# EAGLE design balancer winston-odpor (EAGLE 7.2.0)
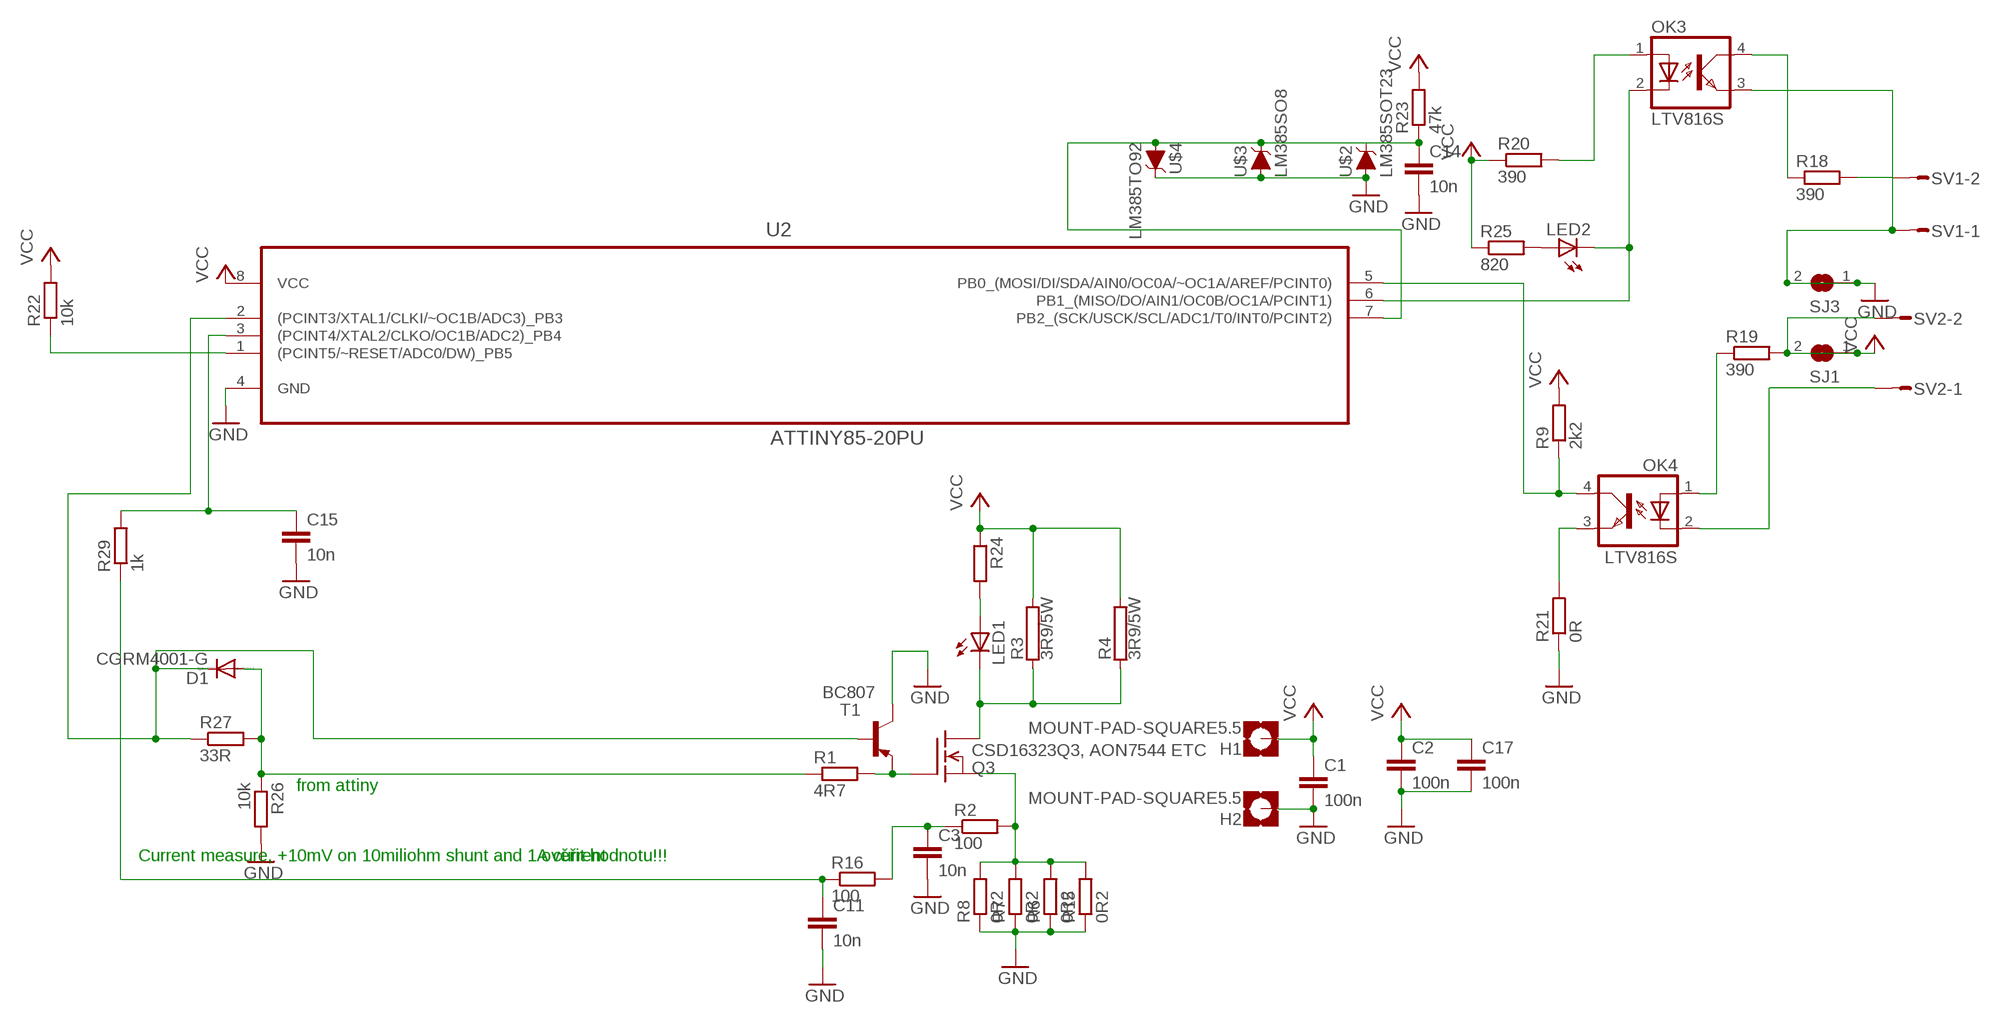
[diagram p0: schematic, sheet 1]

## Parts
C1  100n  C-EUC1210K  [C1210K]
C2  100n  C-EUC1210K  [C1210K]
C3  10n  C-EUC0603  [C0603]
C11  10n  C-EUC0603  [C0603]
C14  10n  C-EUC0603  [C0603]
C15  10n  C-EUC0603  [C0603]
C17  100n  C-EUC1210K  [C1210K]
D1  CGRM4001-G  [SOD-123_MINI-SMA]
H1  MOUNT-PAD-SQUARE5.5  [5,5-PAD-SQUARE]
H2  MOUNT-PAD-SQUARE5.5  [5,5-PAD-SQUARE]
LED1  LED3MM  [LED3MM]
LED2  LED3MM  [LED3MM]
OK3  LTV816S  [SMD4]
OK4  LTV816S  [SMD4]
Q3  CSD16323Q3, AON7544 ETC  CSD16323Q3  [SON33X33]
R1  4R7  R-EU_R0603  [R0603]
R2  100  R-EU_R0603  [R0603]
R3  3R9/5W  RHPS932  [HPS932]
R4  3R9/5W  RHPS932  [HPS932]
R6  0R2  R-EU_M1206  [M1206]
R7  0R2  R-EU_M1206  [M1206]
R8  0R2  R-EU_M1206  [M1206]
R9  2k2  R-EU_R0603  [R0603]
R15  0R2  R-EU_M1206  [M1206]
R16  100  R-EU_R0603  [R0603]
R18  390  R-EU_R0603  [R0603]
R19  390  R-EU_R0603  [R0603]
R20  390  R-EU_R0603  [R0603]
R21  0R  R-EU_R0603  [R0603]
R22  10k  R-EU_R0805  [R0805]
R23  47k  R-EU_R0603  [R0603]
R24  R-EU_R0603  [R0603]
R25  820  R-EU_R0805  [R0805]
R26  10k  R-EU_R0603  [R0603]
R27  33R  R-EU_R0603  [R0603]
R29  1k  R-EU_R0603  [R0603]
SJ1  SJ  [SJ]
SJ3  SJ  [SJ]
SV1  S02P  [S02P]
SV2  S02P  [S02P]
T1  BC807  BC807-16LT1-PNP-SOT23-BEC  [SOT23-BEC]
U2  ATTINY85-20PU  [DIP254P762X533-8]
U$2  LM385SOT23  [SOT23-3]
U$3  LM385SO8  [SO08]
U$4  LM385TO92  [TO-92]

## Nets
GND: C1.2 C2.2 C3.2 C11.2 C14.2 C15.2 C17.2 H2.B5,5(MOUNT) OK3.3(EMIT) R6.1 R7.1 R8.1 R15.1 R21.1 R26.2 SJ3.1 SJ3.2 SV1.1 T1.C U2.4(GND) U$2.1(A) U$3.8(A) U$4.3(C)
N$1: C3.1 R2.1 R16.2
N$2: Q3.4(G) R1.2 T1.E
N$4: Q3.1(S) Q3.2(S) Q3.3(S) R2.2 R6.2 R7.2 R8.2 R15.2
N$16: C15.1 R29.2 U2.3((PCINT4/XTAL2/CLKO/OC1B/ADC2)_PB4)
N$19: C11.1 R16.1 R29.1
N$22: LED1.K(C) Q3.EXP(D) R3.1 R4.1
N$23: LED2.K(C) OK3.2(C) U2.6(PB1_(MISO/DO/AIN1/OC0B/OC1A/PCINT1))
N$24: OK4.1(A) R19.1
N$26: OK4.2(C) SV2.1
N$27: R18.2 SV1.2
N$28: R22.1 U2.1((PCINT5/~RESET/ADC0/DW)_PB5)
N$29: D1.A R1.1 R26.1 R27.2
N$30: D1.C R27.1 T1.B U2.2((PCINT3/XTAL1/CLKI/~OC1B/ADC3)_PB3)
N$31: LED1.A R24.2
N$32: LED2.A R25.2
N$33: OK3.1(A) R20.2
N$35: OK3.4(COL) R18.1
N$37: C14.1 R23.1 U2.7(PB2_(SCK/USCK/SCL/ADC1/T0/INT0/PCINT2)) U$2.2(C) U$3.4(C) U$4.2(A)
N$38: OK4.3(EMIT) R21.2
N$39: OK4.4(COL) R9.1 U2.5(PB0_(MOSI/DI/SDA/AIN0/OC0A/~OC1A/AREF/PCINT0))
VCC: C1.1 C2.1 C17.1 H1.B5,5(MOUNT) R3.2 R4.2 R9.2 R19.2 R20.1 R22.2 R23.2 R24.1 R25.1 SJ1.1 SJ1.2 SV2.2 U2.8(VCC)

## Notes on the sheet
- from attiny
- Current measure, +10mV on 10miliohm shunt and 1A current | ověřit hodnotu!!!

## Library data of the parts
C1-C3 C11 C14 C15 C17 = resistor:C-EU: CAPACITOR, European symbol
D1 = diode:CGRM400*-G: Molded plasitc,JEDEC SOD-123/Mini SMA Source: Comchip CGRM4001-G.pdf
H1 H2 = holes:MOUNT-PAD-SQUARE: MOUNTING PAD, square
LED1 LED2 = led:LED: LED OSRAM: - CHIPLED LG R971, LG N971, LY N971, LG Q971, LY Q971, LO R971, LY R971 LH N974, LH R974 LS Q976, LO Q976, LY Q976 LO Q996 - Hyper CHIPLED LW Q18S LB Q993, LB Q99A, LB R99A - SideLED LS A670, LO A670, LY A670, LG A670, LP A670 LB A673, LV A673, LT A673, LW A673 LH A674 LY A675 LS A676, LA A676, LO A676, LY A676, LW A676 LS A679, LY A679, LG A679 - Hyper Micro SIDELED® LS Y876, LA Y876, LO Y876, LY Y876 LT Y87S - SmartLED LW L88C, LW L88S LB L89C, LB L89S, LG L890 LS L89K, LO L89K, LY L89K LS L896, LA L896, LO L896, LY L896 - TOPLED LS T670, LO T670, LY T670, LG T670, LP T670 LSG T670, LSP T670, LSY T670, LOP T670, LYG T670 LG T671, LOG T671, LSG T671 LB T673, LV T673, LT T673, LW T673 LH T674 LS T676, LA T676, LO T676, LY T676, LB T676, LH T676, LSB T676, LW T676 LB T67C, LV T67C, LT T67C, LS T67K, LO T67K, LY T67K, LW E67C LS E67B, LA E67B, LO E67B, LY E67B, LB E67C, LV E67C, LT E67C LW T67C LS T679, LY T679, LG T679 LS T770, LO T770, LY T770, LG T770, LP T770 LB T773, LV T773, LT T773, LW T773 LH T774 LS E675, LA E675, LY E675, LS T675 LS T776, LA T776, LO T776, LY T776, LB T776 LHGB T686 LT T68C, LB T68C - Hyper Mini TOPLED® LB M676 - Mini TOPLED Santana® LG M470 LS M47K, LO M47K, LY M47K Source: http://www.osram.convergy.de LUXEON: - LUMILED® LXK2-PW12-R00, LXK2-PW12-S00, LXK2-PW14-U00, LXK2-PW14-V00 LXK2-PM12-R00, LXK2-PM12-S00, LXK2-PM14-U00 LXK2-PE12-Q00, LXK2-PE12-R00, LXK2-PE12-S00, LXK2-PE14-T00, LXK2-PE14-U00 LXK2-PB12-K00, LXK2-PB12-L00, LXK2-PB12-M00, LXK2-PB14-N00, LXK2-PB14-P00, LXK2-PB14-Q00 LXK2-PR12-L00, LXK2-PR12-M00, LXK2-PR14-Q00, LXK2-PR14-R00 LXK2-PD12-Q00, LXK2-PD12-R00, LXK2-PD12-S00 LXK2-PH12-R00, LXK2-PH12-S00 LXK2-PL12-P00, LXK2-PL12-Q00, LXK2-PL12-R00 Source: www.luxeon.com KINGBRIGHT: KA-3528ASYC Source: www.kingbright.com
OK3 OK4 = optocoupler:LTV816: OPTO COUPLER Source: LITEON, LTV816.pdf; OC_FARNELL: unknown; OC_NEWARK: unknown
Q3 = SON33:CSD16323Q3
R1 R2 R6-R9 R15 R16 R18-R27 R29 = resistor:R-EU_: RESISTOR, European symbol
R3 R4 = resistor-power:R: Power Resitor; OC_FARNELL: unknown; OC_NEWARK: unknown
SJ1 SJ3 = jumper:SJ: SMD solder JUMPER
SV1 SV2 = con-amp-mt:S02P: AMP MT CONNECTOR; OC_FARNELL: unknown; OC_NEWARK: unknown
T1 = transistor:*-PNP-: PNP Transistror
U2 = attiny85:ATTINY85-20PU: 8-bit Microcontroller with In-System Programmable Flash; MPN: ATTINY85-20PU; OC_FARNELL: 1455162; OC_NEWARK: 58M3796; PACKAGE: PDIP-8; SUPPLIER: Atmel
U$2-U$4 = SparkFun-DiscreteSemi:LM385: LM385 - Voltage Reference

## Board
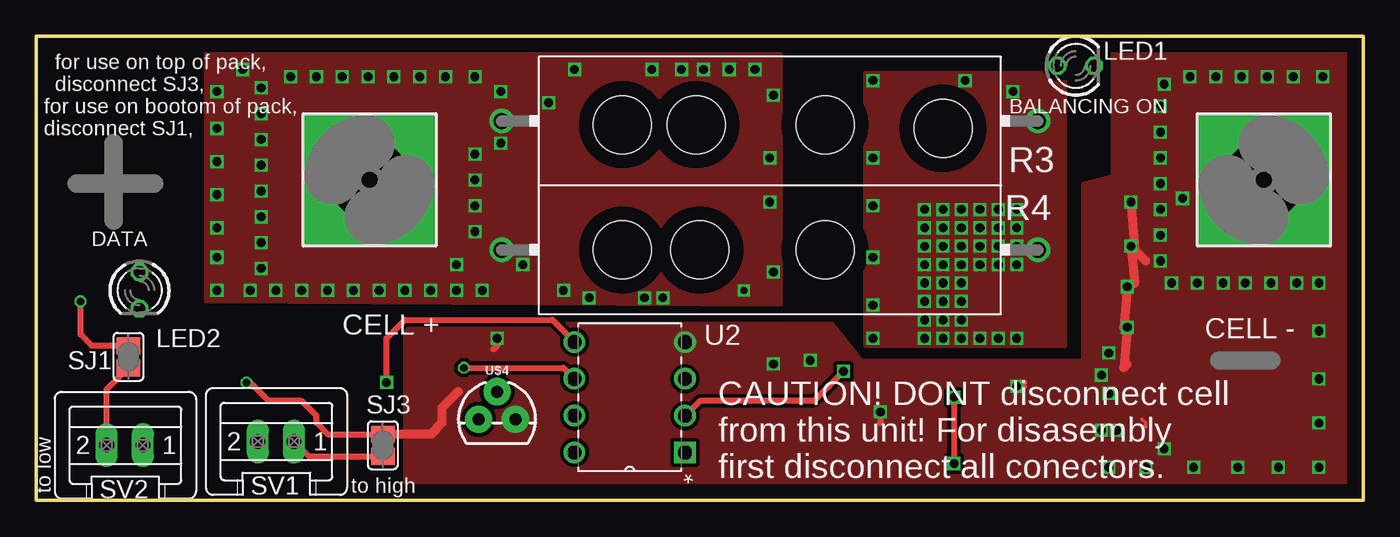
[diagram p1: board, top side]
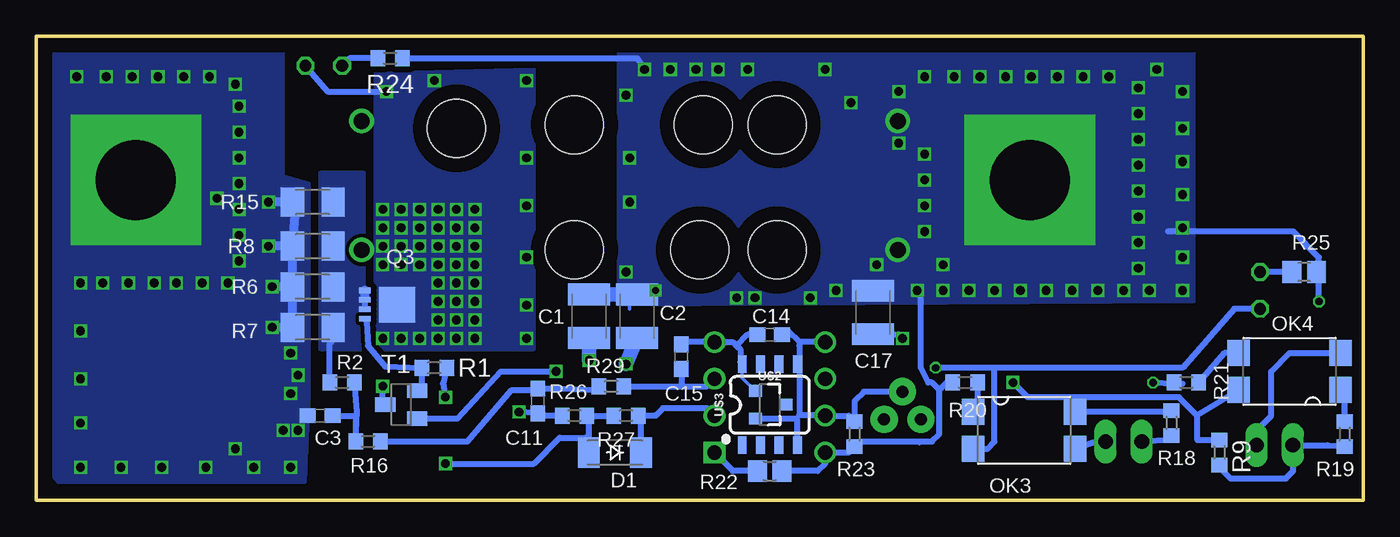
[diagram p2: board, bottom side, seen from below]

Size 91.44 x 32 mm. Coordinates in mm from the lower left corner, seen from the top.
Outline: 0,0 91.44,0 91.44,32 0,32 0,0
Copper layers (1*16): Top 0.035mm / dielectric 1.5mm / Bottom 0.035mm
Design rules "2 vrstvy trida 6": minimum track width 0.15mm, minimum drill 0.3mm, track to track 0.15mm, track to pad 0.15mm, pad to pad 0.15mm, via to via 0.15mm, smd to smd 0.15mm, copper to edge 1mm, drill to drill 0.3mm, minimum pad ring 0.15mm, minimum via ring 0.15mm, stop-mask expansion 0.05mm, vias tented up to drill 3mm, thermal gap 10mil
Holes 4 mm at 45.47,25.91 45.72,17.27 40.39,17.27 40.39,25.91 54.36,25.91 54.36,17.27 62.48,25.65

### Footprints (pad centres in the part's own frame; a part is rotated, then mirrored left to right if it is on the bottom)
C1210K = smd 1.5 x 2.9: 1 -1.5,0; 2 1.5,0
C0603 = smd 1.1 x 1: 1 -0.85,0; 2 0.85,0
SOD-123_MINI-SMA = smd 1.5 x 2.1: A 1.8,0; C -1.8,0
5,5-PAD-SQUARE = drill 5.5 pad 9 square: B5,5 0,0
LED3MM = drill 0.813 octagon: A -1.27,0; K 1.27,0
SMD4 = smd 1.78 x 1.55: 1 -1.27,-3.5; 2 1.27,-3.5; 3 1.27,3.5; 4 -1.27,3.5
SON33X33 = smd 0.4 x 0.8: 1 0.25,-0.975; 2 0.9,-0.975; 3 1.55,-0.975; 4 2.2,-0.975 | smd 2.45 x 2.5: EXP 1.225,1.25
R0603 = smd 1 x 1.1: 1 -0.85,0; 2 0.85,0
HPS932 = drill 1.1 pad 1.7: 1 -18.47,0; 2 18.47,0
M1206 = smd 1.6 x 2: 1 -1.4,0; 2 1.4,0
R0805 = smd 1.3 x 1.5: 1 -0.85,0; 2 0.85,0
SJ = smd 1.168 x 1.6: 1 -0.762,0; 2 0.762,0
S02P = drill 1.016 long: 1 1.25,0; 2 -1.25,0
SOT23-BEC = smd 1 x 1.4: B -0.95,-1.1; C 0,1.1; E 0.95,-1.1
DIP254P762X533-8 = drill 0.991 square: 1 -7.62,7.62 | drill 0.991: 2 -7.62,5.08; 3 -7.62,2.54; 4 -7.62,0; 5 0,0; 6 0,2.54; 7 0,5.08; 8 0,7.62
SOT23-3 = smd 0.8 x 0.9: 1 -0.95,-1; 2 0.95,-1; 3 0,1.1
SO08 = smd 0.6 x 1.2: 1 -1.905,-2.8; 2 -0.635,-2.8; 3 0.635,-2.8; 4 1.905,-2.8; 5 1.905,2.8; 6 0.635,2.8; 7 -0.635,2.8; 8 -1.905,2.8
TO-92 = drill 0.813 pad 1.88: 1 -1.27,0; 2 0,1.905; 3 1.27,0

### Placement (x,y rotation side)
C1  53.34,12.7 270 bottom
C2  50.04,12.7 270 bottom
C3  71.88,5.84 180 bottom
C11  56.9,6.86 270 bottom
C14  40.89,11.43 180 bottom
C15  46.99,9.91 90 bottom
C17  33.78,12.95 270 bottom
D1  51.56,3.3 180 bottom
H1  22.97,22.1 90 top
H2  84.58,22.1 0 top
LED1  71.63,29.97 0 top
LED2  7.11,14.48 270 top
OK3  23.37,4.83 270 bottom
OK4  5.08,8.89 90 bottom
Q3  67.82,14.73 270 bottom
R1  64.01,9.14 180 bottom
R2  70.36,8.13 180 bottom
R3  50.55,26.16 180 top
R4  50.55,17.27 180 top
R6  72.39,14.73 0 bottom
R7  72.39,11.94 0 bottom
R8  72.39,17.53 0 bottom
R9  9.91,3.3 270 bottom
R15  72.39,20.57 0 bottom
R16  68.58,4.06 180 bottom
R18  13.21,5.33 270 bottom
R19  1.27,4.57 270 bottom
R20  27.43,8.13 0 bottom
R21  12.19,8.13 0 bottom
R22  40.89,2.03 0 bottom
R23  35.05,4.57 270 bottom
R24  67.06,30.48 180 bottom
R25  4.06,15.75 180 bottom
R26  54.36,5.84 180 bottom
R27  50.8,5.84 180 bottom
R29  51.82,7.87 0 bottom
SJ1  6.35,9.91 270 top
SJ3  23.88,3.81 270 top
SV1  16.51,4.06 0 top
SV2  6.1,3.81 0 top
T1  66.29,6.6 90 bottom
U2  37.08,10.92 180 top
U$2  40.89,6.6 270 bottom
U$3  40.89,6.6 0 bottom
U$4  31.75,5.59 0 top

### Tracks (layer width: path | path; a pad name or v marks a point on that pad's centre or on a via)
GND  (via drill 0.5, 0.6)
  Top 0.254: 76.45,5.08 76.45,5.33 76.2,5.59 | 14.73,8.13 v14.48,8.13 | SJ3.1 SJ3.2
  Top 0.406: 14.73,8.13 16,6.86 18.29,6.86 19.3,5.84 19.3,5.33 20.07,4.57 SJ3.1 | SV1.1 18.78,3.05 SJ3.2 | v58.17,6.1 58.17,5.33 | v67.56,7.87 68.07,7.87 68.07,8.13 | v31.75,11.18 31.75,10.67 31.5,10.41
  Top 0.61: v75.44,20.57 75.69,17.27 76.45,16.51 | v75.44,17.53 75.69,14.99 | v75.18,14.73 74.93,11.94 75.18,12.19 | v75.18,11.94 74.93,9.14 75.18,9.4 | 29.08,7.49 27.94,6.35 27.94,5.33 27.18,4.57 SJ3.1
  Bottom 0.254: 75.35,11.77 v75.18,11.94 | 42.93,9.53 U$3.8 42.8,8.46 U$2.1 | 46.82,10.92 C15.2
  Bottom 0.406: 43.18,10.67 43.43,10.92 U2.4 46.82,10.92 | 43.18,10.67 42.93,10.41 42.93,9.53 | v14.48,8.13 12.45,8.04 R21.1 | SV1.1 18.52,3.99 OK3.3 | R26.2 56.9,5.84 C11.2 56.64,6.01 v58.17,6.1 | T1.C 67.56,6.6 v67.56,7.87 | C14.2 42.42,11.43 43.18,10.67 | C17.2 32.03,11.45 v31.75,11.18
  Bottom 0.61: v75.44,20.57 R15.1 73.66,20.57 73.54,20.45 R8.1 | R8.1 v75.44,17.53 | R6.1 R8.1 | R6.1 v75.18,14.73 | R6.1 R7.1 v75.18,11.94
  Bottom 1.016: C1.2 v53.34,9.65 | C2.2 v50.8,9.4
  other vias: 74.42,4.83 73.91,2.29 88.39,2.29 88.39,5.33 88.39,8.38 88.39,11.68 85.6,2.29 82.8,2.29 79.76,2.29 76.45,2.29 88.39,14.99 88.65,29.21 73.41,4.83 73.91,7.37 73.91,10.16 77.72,3.56 73.41,8.64 78.99,20.83 84.84,29.21 86.61,29.21 83.06,29.21 81.28,29.21 79.5,29.21 77.72,28.7 77.47,27.18 77.47,25.4 77.47,23.62 77.47,21.84 77.47,20.07 77.47,18.29 77.47,16.51 78.23,14.99 80.01,14.99 81.79,14.99 83.31,14.99 85.09,14.99 86.87,14.99
  pour Top (isolate 0.254, no thermals): 25.4,12.19 54.86,12.19 56.9,9.65 72.14,9.65 72.14,21.84 74.17,22.35 74.17,33.02 90.68,33.02 90.93,0 25.4,0.25
  pour Bottom (isolate 0.406, no thermals): 72.64,21.84 72.64,7.37 72.9,1.27 74.17,0 89.15,0.51 90.93,2.29 90.68,33.02 74.42,33.27 74.42,22.35
N$1
  Bottom 0.406: C3.1 69.43,5.84 R16.2 69.34,6.1 R2.1
N$2
  Bottom 0.406: Q3.4 68.67,12.28 68.58,10.67 67.4,9.23 R1.2 64.86,7.55 T1.E
N$4
  Bottom 0.254: 71.37,11.43 71.12,11.55 R7.2
  Bottom 0.406: Q3.3 Q3.2 | R2.2 71.21,10.83 71.12,10.92 71.12,11.18 71.37,11.43
  Bottom 0.61: Q3.2 Q3.1
  pour Bottom (isolate 0.254, no thermals): 68.83,22.61 68.83,10.41 71.88,10.41 71.88,22.61
N$16
  Bottom 0.406: 44.79,8.29 U2.3 45.21,7.87 46.99,7.87 | R29.2 46.99,7.87 | C15.1 46.99,7.87
N$19
  Bottom 0.406: R16.1 61.72,4.06 58.67,7.62 56.98,7.62 C11.1 55.28,7.71 52.83,7.62 R29.1
N$22  (via drill 0.6)
  Bottom 0.406: LED1.K 71.37,28.19 v67.31,28.19
  other vias: 67.56,20.07 66.29,17.53 65.02,17.53 63.75,16.26 63.75,14.99 63.75,13.72 65.02,16.26 66.29,16.26 63.75,12.45 65.02,11.18 67.56,17.53 66.29,20.07 65.02,20.07 64.01,28.96 57.66,20.32 62.48,20.07 63.75,20.07 61.21,18.8 61.21,17.53 61.21,16.26 61.21,14.99 61.21,13.72 61.21,11.18 61.21,12.45 57.66,11.18 67.56,16.26 63.75,17.53 57.66,16.76 57.66,28.96 57.66,23.62 57.66,13.46 61.21,20.07 66.29,11.18 67.56,11.18 63.75,11.18 62.48,11.18 62.48,12.45 62.48,13.72 62.48,14.99 62.48,16.26 62.48,17.53 62.48,18.8 63.75,18.8 65.02,18.8 66.29,18.8 67.56,18.8
  pour Bottom (isolate 0.406, no thermals): 68.07,10.41 57.15,10.41 57.15,29.72 68.07,29.46
  pour Top (isolate 0.406, no thermals): 57.15,29.46 57.15,10.67 70.87,10.67 70.87,29.46
N$23  (via drill 0.5)
  Top 0.406: v29.46,9.14 36.32,9.14 U2.6
  Bottom 0.406: LED2.K 8.89,13.21 12.45,9.14 25.4,9.14 | 25.4,9.14 v29.46,9.14 | OK3.2 25.91,3.56 25.4,4.06 25.4,9.14
N$24
  Bottom 0.254: 1.02,7.37 1.78,8.13
  Bottom 0.305: 1.27,7.06 OK4.1
  Bottom 0.406: R19.1 1.27,7.06 1.27,7.11 1.02,7.37
N$26
  Bottom 0.406: SV2.1 7.35,4.85 6.35,5.84 6.35,8.89 5.08,10.16 OK4.2
N$27
  Bottom 0.406: SV1.2 13.74,4.17 R18.2
N$28
  Bottom 0.406: R22.1 43.43,2.03 U2.1
N$29  (via drill 0.6)
  Top 0.406: v63.25,7.11 v63.25,2.54
  Bottom 0.406: D1.A 53.36,4.06 | 53.36,4.06 53.36,5.7 R26.1 R27.2 | R1.1 63.41,8.04 v63.25,7.11 | v63.25,2.54 57.15,2.54 55.37,4.32 53.62,4.32 53.36,4.06
N$30  (via drill 0.6)
  Top 0.406: v55.63,8.89 53.59,6.86 45.72,6.86 U2.2
  Bottom 0.406: U2.2 45.21,6.35 48.26,6.35 48.77,5.84 R27.1 49.76,5.65 D1.C | T1.B 62.42,5.65 59.44,8.89 v55.63,8.89
N$31
  Bottom 0.406: R24.2 69.85,30.48 LED1.A
N$32
  Bottom 0.406: R25.2 LED2.A
N$33
  Bottom 0.406: R20.2 26.58,6.38 OK3.1
N$35
  Bottom 0.406: R18.1 13.77,6.1 OK3.4
N$37
  Bottom 0.254: 38.99,5.53 39.12,5.65 38.86,5.91 | C14.1 39.62,11.68
  Bottom 0.406: U$2.2 39.12,5.65 | U$3.4 38.99,5.53 | 39.62,11.68 38.86,10.92 38.86,5.91 37.15,5.91 U2.7 35.47,5.84 R23.1 35.05,6.86 34.42,7.49 U$4.2
N$38
  Bottom 0.406: OK4.3 9.56,10.16 R21.2
N$39  (via drill 0.6)
  Top 0.406: v24.13,8.13 24.13,11.18 25.4,12.45 35.56,12.45 U2.5
  Bottom 0.406: 11.43,5.9 11.43,4.15 R9.1 | 11.43,5.9 OK4.4 | U2.5 38.86,10.92 38.86,10.67 | 11.43,5.9 11.49,5.9 12.7,7.11 23.11,7.11 v24.13,8.13
VCC  (via drill 0.5, 0.6)
  Top 0.254: SJ1.2 SJ1.1
  Top 0.406: SJ1.1 3.81,10.67 3.05,11.43 v3.05,13.72 | SV2.2 4.85,7.64 SJ1.2
  Bottom 0.254: 50.55,13.21 50.55,14.2 C2.1 | 34.71,4.06 R23.2 | 30.57,3.9 30.73,4.06
  Bottom 0.305: v3.05,13.72 3.05,15.58 R25.1
  Bottom 0.406: R23.2 35.47,3.3 U2.8 37.08,2.54 37.59,2.03 R22.2 | 34.71,4.06 30.73,4.06 29.72,4.06 29.21,4.57 29.21,7.62 | 29.21,7.62 29.72,8.13 29.97,8.13 30.48,9.14 30.48,14.22 | v3.05,13.72 3.05,16.76 4.83,18.54 13.46,18.54 | R19.2 2.45,3.81 SV2.2 4.83,3.79 4.83,2.03 5.33,1.52 9.14,1.52 9.91,2.29 R9.2 | 49.05,14.2 v48.77,14.48 | R24.1 50.04,30.48 v49.53,29.72 | R20.1 28.7,8.13 29.21,7.62
  Bottom 1.016: C1.1 49.05,14.2
  other vias: 50.8,27.94 42.42,29.72 45.97,29.72 12.45,21.08 14.73,14.48 47.75,29.72 44.45,29.72 12.45,28.19 12.45,25.65 12.45,23.37 12.45,18.8 12.45,16.76 12.45,14.48 16.51,14.48 18.29,14.48 20.07,14.48 21.84,14.48 23.62,14.48 25.4,14.48 36.32,14.48 38.1,13.97 41.91,13.97 43.18,13.97 50.8,15.75 50.55,20.57 50.55,23.62 28.96,16.26 30.23,18.54 30.23,20.32 30.23,22.1 30.23,23.88 32,24.64 32,28.19 30.23,29.21 15.49,28.45 15.49,26.67 15.49,24.89 15.49,23.11 15.49,21.34 15.49,19.56 15.49,17.78 15.49,16 27.18,14.48 28.96,14.48 35.31,27.43 14.22,29.72 37.08,29.72 17.53,29.21 19.3,29.21 21.08,29.21 22.86,29.21 24.64,29.21 26.42,29.21 28.19,29.21 30.73,14.48 33.53,16.26
  pour Bottom (isolate 0.254, no thermals): 11.68,32.26 51.31,32.26 51.31,13.46 11.68,13.72
  pour Top (isolate 0.254, no thermals): 11.68,32.26 51.31,32 51.31,13.46 11.68,13.72

### Text on the board
tNames: for use on top of pack, / disconnect SJ3, | BALANCING ON | for use on bootom of pack, / disconnect SJ1, | DATA | CELL + | CELL - | to high | CAUTION! DONT disconnect cell / from this unit! For disasembly / first disconnect all conectors. | to low